# EAGLE schematic harp behavior (EAGLE 9.6.2)

## Sheet 1 of 4
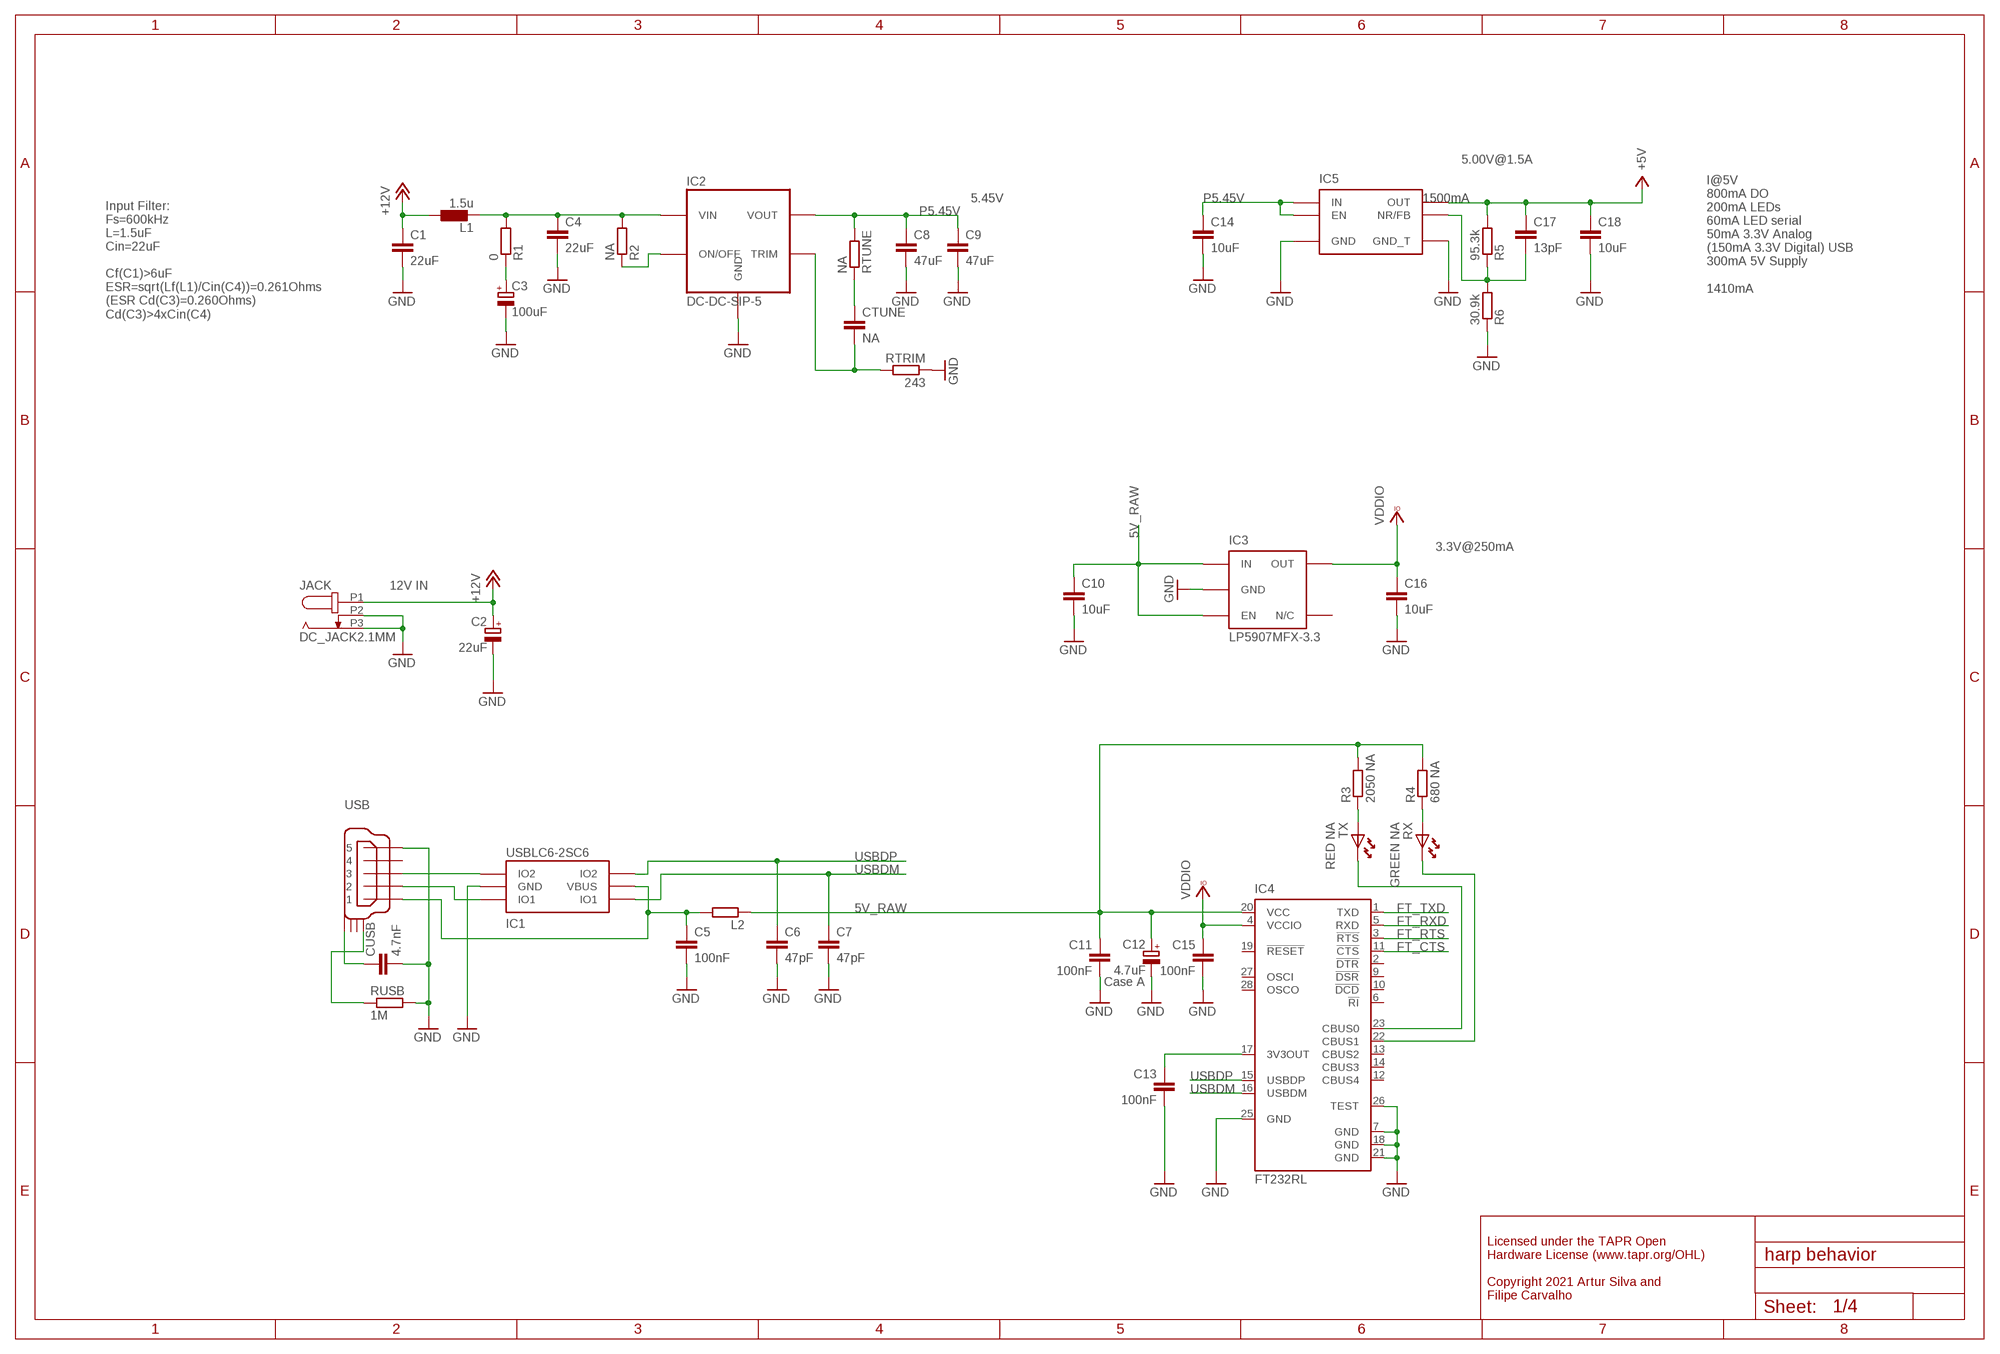
[diagram p0: schematic, sheet 1]

### Parts
C1  22uF  C-EUC1210  [C1210]
C2  22uF  CAP_100UFHAND  [CAP_100UF_HAND]
C3  100uF  CPOL-EUE  [PANASONIC_E]
C4  22uF  C-EUC1210  [C1210]
C5  100nF  C-EUC0402  [C0402]
C6  47pF  C-EUC0402  [C0402]
C7  47pF  C-EUC0402  [C0402]
C8  47uF  C-EUC1210  [C1210]
C9  47uF  C-EUC1210  [C1210]
C10  10uF  C-EUC0603  [C0603]
C11  100nF  C-EUC0402  [C0402]
C12  4.7uF  CPOL-EUA/3216-18W  [A/3216-18W]
C13  100nF  C-EUC0402  [C0402]
C14  10uF  C-EUC0603  [C0603]
C15  100nF  C-EUC0402  [C0402]
C16  10uF  C-EUC0603  [C0603]
C17  13pF  C-EUC0402  [C0402]
C18  10uF  C-EUC0603  [C0603]
CTUNE  NA  C-EUC0402  [C0402]
CUSB  4.7nF  C-EUC0402  [C0402]
IC1  USBLC6-2SC6  USBLC6-2  [SOT23-6L]
IC2  DC-DC-SIP-5  [SIP-5]
IC3  LP5907MFX-3.3  TLV700XX  [TSOT23-5]
IC4  FT232RL  [SSOP28]
IC5  TPS78601SON  [SON-8]
JACK  DC_JACK2.1MM  [DC_POWER_INPUT_2.1MM]
L1  1.5u  INDLPS4012_L  [IND_LPS4012_V2]
L2  ???  R-EU_R0805  [R0805]
R1  0  R-EU_R0402  [R0402]
R2  NA  R-EU_R0402  [R0402]
R3  2050 NA  R-EU_R0402  [R0402]
R4  680 NA  R-EU_R0402  [R0402]
R5  95.3k  R-EU_R0402  [R0402]
R6  30.9k  R-EU_R0402  [R0402]
RTRIM  243  R-EU_R0402  [R0402]
RTUNE  NA  R-EU_R0402  [R0402]
RUSB  1M  R-EU_R0402  [R0402]
RX  GREEN NA  LEDHAND  [LED_HAND]
TX  RED NA  LEDHAND  [LED_HAND]
USB  USB_MINI_B  [240-0002-1]

### Nets
5V_RAW: C10.1 C11.1 C12.+ IC3.1(IN) IC3.3(EN) IC4.20(VCC) L2.1 R3.2 R4.2
+5V: C17.1 C18.1 IC5.P3(OUT) IC5.P4(OUT) R5.2 ; also sheet 2,3,4
+12V: C1.1 C2.+ JACK.P1 L1.1 ; also sheet 4
DCIN: C4.1 IC2.P2(VIN) L1.2 R1.2 R2.2
FT_CTS: IC4.11(!CTS) ; also sheet 2
FT_RTS: IC4.3(!RTS) ; also sheet 2
FT_RXD: IC4.5(RXD) ; also sheet 2
FT_TXD: IC4.1(TXD) ; also sheet 2
GND: C1.2 C2.- C3.- C4.2 C5.2 C6.2 C7.2 C8.2 C9.2 C10.2 C11.2 C12.- C13.2 C14.2 C15.2 C16.2 C18.2 CUSB.2 IC1.P$2(GND) IC2.P3(GND) IC3.2(GND) IC4.7(GND) IC4.18(GND) IC4.21(GND) IC4.25(GND) IC4.26(TEST) IC5.P6(GND) IC5.P9(GND_T) JACK.P2 JACK.P3 R6.1 RTRIM.1 RUSB.2 USB.P$5 ; also sheet 2,3,4
N$12: CTUNE.2 IC2.P5(TRIM) RTRIM.2
N$14: CTUNE.1 RTUNE.1
N$16: IC2.P1(ON/OFF) R2.1
N$20: C17.2 IC5.P5(NR/FB) R5.1 R6.2
N$24: C3.+ R1.1
N$38: C13.1 IC4.17(3V3OUT)
N$39: C5.1 IC1.P$5(VBUS) L2.2 USB.P$1
N$40: IC1.P$1(IO1) USB.P$2
N$47: R4.1 RX.A
N$48: IC4.23(CBUS0) TX.K
N$49: IC4.22(CBUS1) RX.K
N$50: IC1.P$3(IO2) USB.P$3
N$59: CUSB.1 USB.SHIELD_4
N$61: RUSB.1 USB.SHIELD_1
N$62: R3.1 TX.A
P5.45V: C8.1 C9.1 C14.1 IC2.P4(VOUT) IC5.P1(IN) IC5.P2(IN) IC5.P8(EN) RTUNE.2
USBDM: C7.1 IC1.P$6(IO1) IC4.16(USBDM)
USBDP: C6.1 IC1.P$4(IO2) IC4.15(USBDP)
VCCIO: C15.1 C16.1 IC3.5(OUT) IC4.4(VCCIO) ; supply symbol labelled VDDIO ; also sheet 2,3,4
Unconnected: IC3.4(N/C) IC4.2(!DTR) IC4.6(!RI) IC4.9(!DSR) IC4.10(!DCD) IC4.12(CBUS4) IC4.13(CBUS2) IC4.14(CBUS3) IC4.19(!RESET) IC4.27(OSCI) IC4.28(OSCO) USB.P$4 USB.SHIELD_2 USB.SHIELD_3

### Notes on the sheet
- 5.00V@1.5A
- 5.45V | 1500mA
- I@5V
  800mA DO
  200mA LEDs
  60mA LED serial
  50mA 3.3V Analog
  (150mA 3.3V Digital) USB
  300mA 5V Supply
  
  1410mA
- Input Filter:
  Fs=600kHz
  L=1.5uF
  Cin=22uF
  
  Cf(C1)>6uF
  ESR=sqrt(Lf(L1)/Cin(C4))=0.261Ohms
  (ESR Cd(C3)=0.260Ohms)
  Cd(C3)>4xCin(C4)
- 3.3V@250mA
- 12V IN
- Case A
- Licensed under the TAPR Open
  Hardware License (www.tapr.org/OHL)
  
  Copyright 2021 Artur Silva and 
  Filipe Carvalho

## Sheet 2 of 4
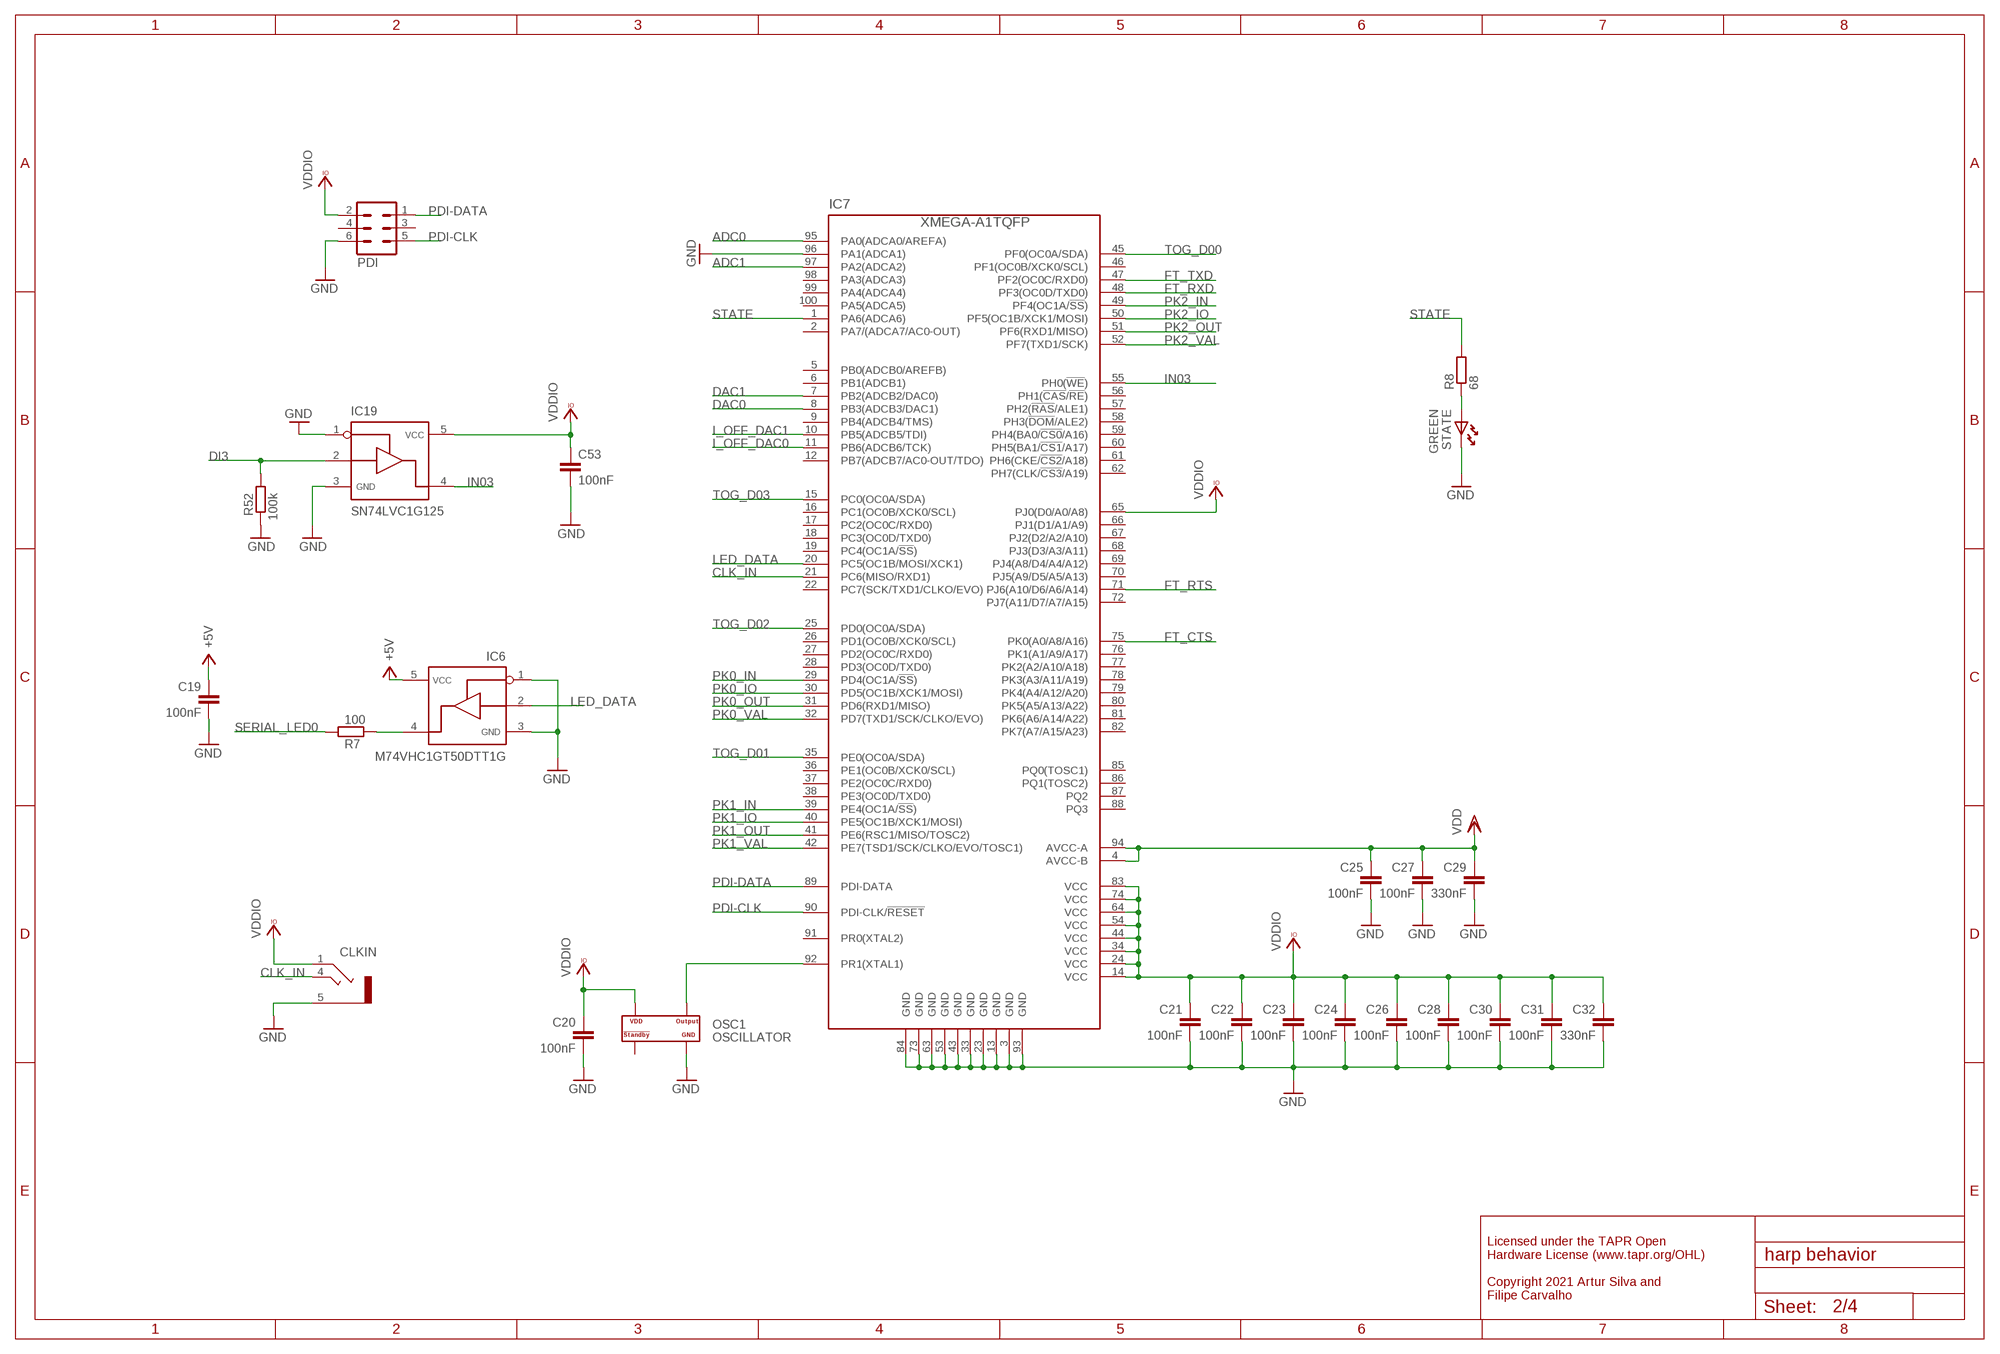
[diagram p1: schematic, sheet 2]

### Parts
C19  100nF  C-EUC0402  [C0402]
C20  100nF  C-EUC0402  [C0402]
C21  100nF  C-EUC0402  [C0402]
C22  100nF  C-EUC0402  [C0402]
C23  100nF  C-EUC0402  [C0402]
C24  100nF  C-EUC0402  [C0402]
C25  100nF  C-EUC0402  [C0402]
C26  100nF  C-EUC0402  [C0402]
C27  100nF  C-EUC0402  [C0402]
C28  100nF  C-EUC0402  [C0402]
C29  330nF  C-EUC0402  [C0402]
C30  100nF  C-EUC0402  [C0402]
C31  100nF  C-EUC0402  [C0402]
C32  330nF  C-EUC0402  [C0402]
C53  100nF  C-EUC0402  [C0402]
CLKIN  STEREO_JACK  [35RASMT2BHNTRX]
IC6  M74VHC1GT50DTT1G  SN74LVC1G125  [SOT23-5]
IC7  XMEGA-A1TQFP  [TQFP100]
IC19  SN74LVC1G125  [SOT23-5]
OSC1  OSCILLATOR  [OSCILLATOR_3.2X2.5]
PDI  MA03-2  [MA03-2]
R7  100  R-EU_R0402  [R0402]
R8  68  R-EU_R0402  [R0402]
R52  100k  R-EU_R0402  [R0402]
STATE  GREEN  LEDHAND  [LED_HAND]

### Nets
+5V: C19.1 IC6.5 ; also sheet 1,3,4
ADC0: IC7.95(PA0(ADCA0/AREFA)) ; also sheet 3
ADC1: IC7.97(PA2(ADCA2)) ; also sheet 3
CLK_IN: CLKIN.4 IC7.21(PC6(MISO/RXD1))
DAC0: IC7.8(PB3(ADCB3/DAC1)) ; also sheet 3
DAC1: IC7.7(PB2(ADCB2/DAC0)) ; also sheet 3
DI3: IC19.2 R52.1 ; also sheet 3
FT_CTS: IC7.75(PK0(A0/A8/A16)) ; also sheet 1
FT_RTS: IC7.71(PJ6(A10/D6/A6/A14)) ; also sheet 1
FT_RXD: IC7.48(PF3(OC0D/TXD0)) ; also sheet 1
FT_TXD: IC7.47(PF2(OC0C/RXD0)) ; also sheet 1
GND: C19.2 C20.2 C21.2 C22.2 C23.2 C24.2 C25.2 C26.2 C27.2 C28.2 C29.2 C30.2 C31.2 C32.2 C53.2 CLKIN.5 IC6.1 IC6.3 IC7.3(GND) IC7.13(GND) IC7.23(GND) IC7.33(GND) IC7.43(GND) IC7.53(GND) IC7.63(GND) IC7.73(GND) IC7.84(GND) IC7.93(GND) IC7.96(PA1(ADCA1)) IC19.1 IC19.3 OSC1.P$2(GND) PDI.6 R52.2 STATE.K ; also sheet 1,3,4
I_OFF_DAC0: IC7.11(PB6(ADCB6/TCK)) ; also sheet 3
I_OFF_DAC1: IC7.10(PB5(ADCB5/TDI)) ; also sheet 3
IN03: IC7.55(PH0(!WE!)) IC19.4
LED_DATA: IC6.2 IC7.20(PC5(OC1B/MOSI/XCK1))
N$13: IC6.4 R7.2
N$23: R8.1 STATE.A
OSC1: IC7.92(PR1(XTAL1)) OSC1.P$3(OUTPUT)
PDI-CLK: IC7.90(PDI-CLK/!RESET) PDI.5
PDI-DATA: IC7.89(PDI-DATA) PDI.1
PK0_IN: IC7.29(PD4(OC1A/!SS!)) ; also sheet 4
PK0_IO: IC7.30(PD5(OC1B/XCK1/MOSI)) ; also sheet 4
PK0_OUT: IC7.31(PD6(RXD1/MISO)) ; also sheet 4
PK0_VAL: IC7.32(PD7(TXD1/SCK/CLKO/EVO)) ; also sheet 4
PK1_IN: IC7.39(PE4(OC1A/!SS!)) ; also sheet 4
PK1_IO: IC7.40(PE5(OC1B/XCK1/MOSI)) ; also sheet 4
PK1_OUT: IC7.41(PE6(RSC1/MISO/TOSC2)) ; also sheet 4
PK1_VAL: IC7.42(PE7(TSD1/SCK/CLKO/EVO/TOSC1)) ; also sheet 4
PK2_IN: IC7.49(PF4(OC1A/!SS!)) ; also sheet 4
PK2_IO: IC7.50(PF5(OC1B/XCK1/MOSI)) ; also sheet 4
PK2_OUT: IC7.51(PF6(RXD1/MISO)) ; also sheet 4
PK2_VAL: IC7.52(PF7(TXD1/SCK)) ; also sheet 4
SERIAL_LED0: R7.1 ; also sheet 3
STATE: IC7.1(PA6(ADCA6)) R8.2
TOG_D00: IC7.45(PF0(OC0A/SDA)) ; also sheet 3
TOG_D01: IC7.35(PE0(OC0A/SDA)) ; also sheet 3
TOG_D02: IC7.25(PD0(OC0A/SDA)) ; also sheet 3
TOG_D03: IC7.15(PC0(OC0A/SDA)) ; also sheet 3
VCCIO: C20.1 C21.1 C22.1 C23.1 C24.1 C26.1 C28.1 C30.1 C31.1 C32.1 C53.1 CLKIN.1 IC7.14(VCC) IC7.24(VCC) IC7.34(VCC) IC7.44(VCC) IC7.54(VCC) IC7.64(VCC) IC7.65(PJ0(D0/A0/A8)) IC7.74(VCC) IC7.83(VCC) IC19.5 OSC1.P$4(VDD) PDI.2 ; supply symbol labelled VDDIO ; also sheet 1,3,4
VDD: C25.1 C27.1 C29.1 IC7.4(AVCC-B) IC7.94(AVCC-A) ; also sheet 3
Unconnected: IC7.2(PA7/(ADCA7/AC0-OUT)) IC7.5(PB0(ADCB0/AREFB)) IC7.6(PB1(ADCB1)) IC7.9(PB4(ADCB4/TMS)) IC7.12(PB7(ADCB7/AC0-OUT/TDO)) IC7.16(PC1(OC0B/XCK0/SCL)) IC7.17(PC2(OC0C/RXD0)) IC7.18(PC3(OC0D/TXD0)) IC7.19(PC4(OC1A/!SS!)) IC7.22(PC7(SCK/TXD1/CLKO/EVO)) IC7.26(PD1(OC0B/XCK0/SCL)) IC7.27(PD2(OC0C/RXD0)) IC7.28(PD3(OC0D/TXD0)) IC7.36(PE1(OC0B/XCK0/SCL)) IC7.37(PE2(OC0C/RXD0)) IC7.38(PE3(OC0D/TXD0)) IC7.46(PF1(OC0B/XCK0/SCL)) IC7.56(PH1(!CAS!/!RE!)) IC7.57(PH2(!RAS!/ALE1)) IC7.58(PH3(!DOM!/ALE2)) IC7.59(PH4(BA0/!CS0!/A16)) IC7.60(PH5(BA1/!CS1!/A17)) IC7.61(PH6(CKE/!CS2!/A18)) IC7.62(PH7(CLK/!CS3!/A19)) IC7.66(PJ1(D1/A1/A9)) IC7.67(PJ2(D2/A2/A10)) IC7.68(PJ3(D3/A3/A11)) IC7.69(PJ4(A8/D4/A4/A12)) IC7.70(PJ5(A9/D5/A5/A13)) IC7.72(PJ7(A11/D7/A7/A15)) IC7.76(PK1(A1/A9/A17)) IC7.77(PK2(A2/A10/A18)) IC7.78(PK3(A3/A11/A19)) IC7.79(PK4(A4/A12/A20)) IC7.80(PK5(A5/A13/A22)) IC7.81(PK6(A6/A14/A22)) IC7.82(PK7(A7/A15/A23)) IC7.85(PQ0(TOSC1)) IC7.86(PQ1(TOSC2)) IC7.87(PQ2) IC7.88(PQ3) IC7.91(PR0(XTAL2)) IC7.98(PA3(ADCA3)) IC7.99(PA4(ADCA4)) IC7.100(PA5(ADCA5)) OSC1.P$1(STANDBY#) PDI.3 PDI.4

### Notes on the sheet
- Licensed under the TAPR Open
  Hardware License (www.tapr.org/OHL)
  
  Copyright 2021 Artur Silva and 
  Filipe Carvalho

## Sheet 3 of 4
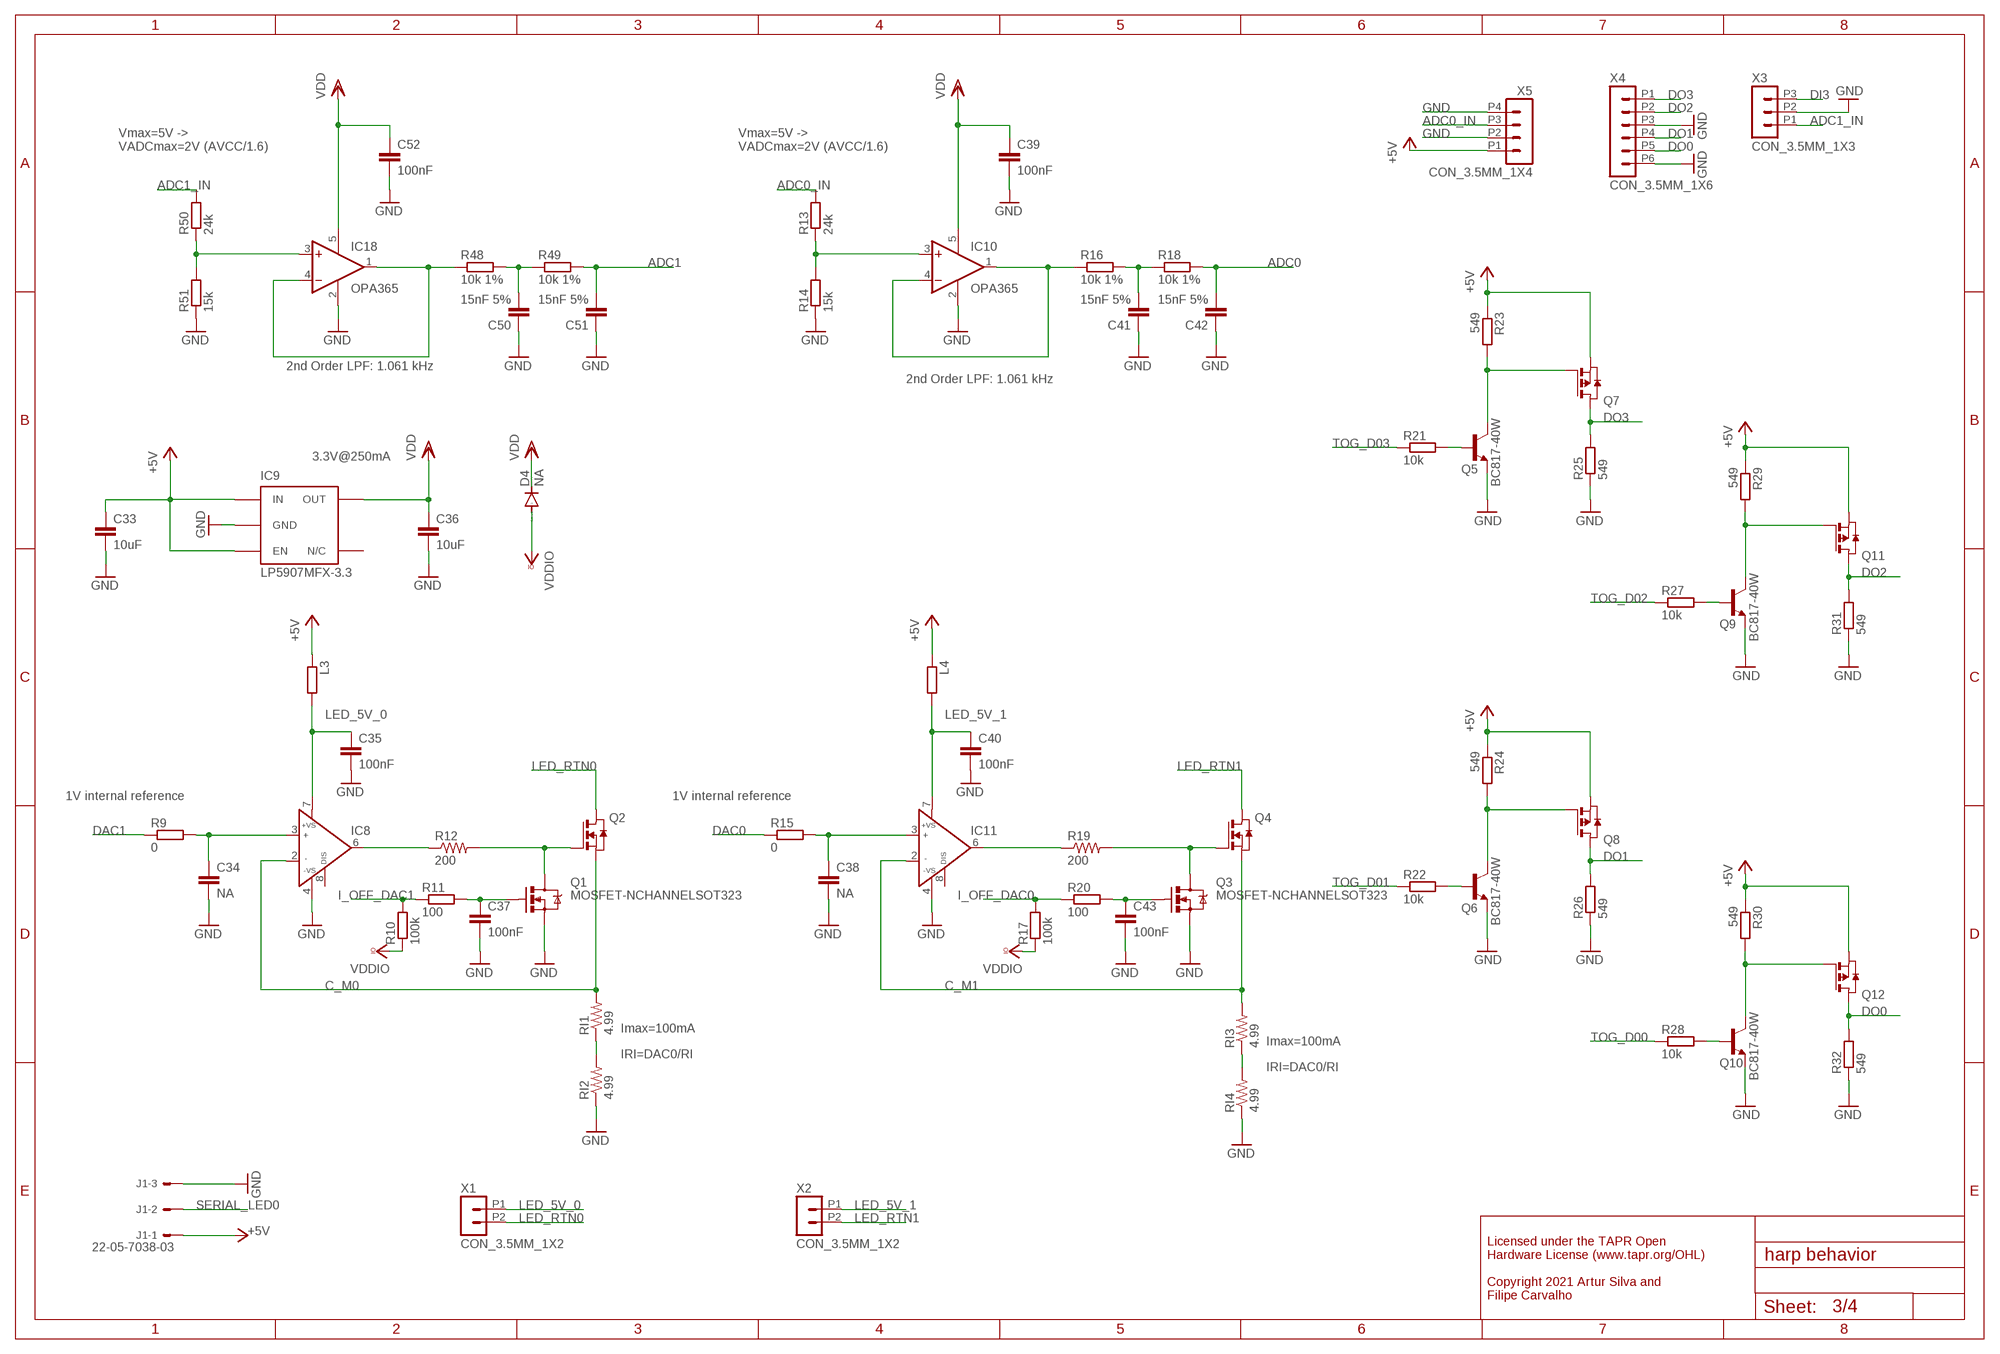
[diagram p2: schematic, sheet 3]

### Parts
C33  10uF  C-EUC0603  [C0603]
C34  NA  C-EUC0402  [C0402]
C35  100nF  C-EUC0402  [C0402]
C36  10uF  C-EUC0603  [C0603]
C37  100nF  C-EUC0402  [C0402]
C38  NA  C-EUC0402  [C0402]
C39  100nF  C-EUC0402  [C0402]
C40  100nF  C-EUC0402  [C0402]
C41  15nF 5%  C-EUC0402  [C0402]
C42  15nF 5%  C-EUC0402  [C0402]
C43  100nF  C-EUC0402  [C0402]
C50  15nF 5%  C-EUC0402  [C0402]
C51  15nF 5%  C-EUC0402  [C0402]
C52  100nF  C-EUC0402  [C0402]
D4  NA  DIODE  [SOD-323-DIODE]
IC8  AD8041R  [SO8]
IC9  LP5907MFX-3.3  TLV700XX  [TSOT23-5]
IC10  OPA365  [SOT23-5]
IC11  AD8041R  [SO8]
IC18  OPA365  [SOT23-5]
J1  22-05-7038-03  [7395-03]
L3  600@100M  R-EU_R0805  [R0805]
L4  600@100M  R-EU_R0805  [R0805]
Q1  MOSFET-NCHANNELSOT323  [SOT323]
Q2  NMOSSOT223  [SOT223]
Q3  MOSFET-NCHANNELSOT323  [SOT323]
Q4  NMOSSOT223  [SOT223]
Q5  BC817-40W  BC817  [SOT323-BEC]
Q6  BC817-40W  BC817  [SOT323-BEC]
Q7  PMOSSOT223  [SOT223]
Q8  PMOSSOT223  [SOT223]
Q9  BC817-40W  BC817  [SOT323-BEC]
Q10  BC817-40W  BC817  [SOT323-BEC]
Q11  PMOSSOT223  [SOT223]
Q12  PMOSSOT223  [SOT223]
R9  0  R-EU_R0402  [R0402]
R10  100k  R-EU_R0402  [R0402]
R11  100  R-EU_R0402  [R0402]
R12  200  R-US_R1210  [R1210]
R13  24k  R-EU_R0402  [R0402]
R14  15k  R-EU_R0402  [R0402]
R15  0  R-EU_R0402  [R0402]
R16  10k 1%  R-EU_R0402  [R0402]
R17  100k  R-EU_R0402  [R0402]
R18  10k 1%  R-EU_R0402  [R0402]
R19  200  R-US_R1210  [R1210]
R20  100  R-EU_R0402  [R0402]
R21  10k  R-EU_R0402  [R0402]
R22  10k  R-EU_R0402  [R0402]
R23  549  R-EU_R0805  [R0805]
R24  549  R-EU_R0805  [R0805]
R25  549  R-EU_R0805  [R0805]
R26  549  R-EU_R0805  [R0805]
R27  10k  R-EU_R0402  [R0402]
R28  10k  R-EU_R0402  [R0402]
R29  549  R-EU_R0805  [R0805]
R30  549  R-EU_R0805  [R0805]
R31  549  R-EU_R0805  [R0805]
R32  549  R-EU_R0805  [R0805]
R48  10k 1%  R-EU_R0402  [R0402]
R49  10k 1%  R-EU_R0402  [R0402]
R50  24k  R-EU_R0402  [R0402]
R51  15k  R-EU_R0402  [R0402]
RI1  4.99  R-US_R2512  [R2512]
RI2  4.99  R-US_R2512  [R2512]
RI3  4.99  R-US_R2512  [R2512]
RI4  4.99  R-US_R2512  [R2512]
X1  CON_3.5MM_1X2  [CON_3.5MM_1X2]
X2  CON_3.5MM_1X2  [CON_3.5MM_1X2]
X3  CON_3.5MM_1X3  [CON_3.5MM_1X3]
X4  CON_3.5MM_1X6  [CON_3.5MM_1X6]
X5  CON_3.5MM_1X4  [CON_3.5MM_1X4]

### Nets
+5V: C33.1 IC9.1(IN) IC9.3(EN) J1.1 L3.1 L4.1 Q7.3(S) Q8.3(S) Q11.3(S) Q12.3(S) R23.1 R24.1 R29.1 R30.1 X5.P1 ; also sheet 1,2,4
ADC0: C42.2 R18.2 ; also sheet 2
ADC0_IN: R13.2 X5.P3
ADC1: C51.2 R49.2 ; also sheet 2
ADC1_IN: R50.2 X3.P1
C_M0: IC8.2(IN-) Q2.3(S) RI1.2
C_M1: IC11.2(IN-) Q4.3(S) RI3.2
CTRL_BL: IC11.6(OUT) R19.1
CTRL_BL1: IC8.6(OUT) R12.1
DAC0: R15.1 ; also sheet 2
DAC1: R9.1 ; also sheet 2
DI3: X3.P3 ; also sheet 2
DO0: Q12.2(D) Q12.4(D) R32.2 X4.P5
DO1: Q8.2(D) Q8.4(D) R26.2 X4.P4
DO2: Q11.2(D) Q11.4(D) R31.2 X4.P2
DO3: Q7.2(D) Q7.4(D) R25.2 X4.P1
GND: C33.2 C34.2 C35.2 C36.2 C37.2 C38.2 C39.2 C40.2 C41.1 C42.1 C43.2 C50.1 C51.1 C52.2 IC8.4(-VS) IC9.2(GND) IC10.2(V-) IC11.4(-VS) IC18.2(V-) J1.3 Q1.2(S) Q3.2(S) Q5.E Q6.E Q9.E Q10.E R14.1 R25.1 R26.1 R31.1 R32.1 R51.1 RI2.1 RI4.1 X3.P2 X4.P3 X4.P6 X5.P2 X5.P4 ; also sheet 1,2,4
I_OFF_DAC0: R17.2 R20.1 ; also sheet 2
I_OFF_DAC1: R10.2 R11.1 ; also sheet 2
LED_5V_0: C35.1 IC8.7(+VS) L3.2 X1.P1
LED_5V_1: C40.1 IC11.7(+VS) L4.2 X2.P1
LED_RTN0: Q2.2(D) Q2.4(D) X1.P2
LED_RTN1: Q4.2(D) Q4.4(D) X2.P2
N$1: Q3.3(D) Q4.1(G) R19.2
N$3: Q6.C Q8.1(G) R24.2
N$5: Q6.B R22.2
N$7: Q9.C Q11.1(G) R29.2
N$8: Q9.B R27.2
N$9: Q10.C Q12.1(G) R30.2
N$10: Q10.B R28.2
N$11: Q1.3(D) Q2.1(G) R12.2
N$15: C34.1 IC8.3(IN+) R9.2
N$18: C50.2 R48.2 R49.1
N$19: IC18.1(OUT) IC18.4(-IN) R48.1
N$21: C38.1 IC11.3(IN+) R15.2
N$22: RI1.1 RI2.2
N$25: Q5.C Q7.1(G) R23.2
N$27: Q5.B R21.2
N$28: C37.1 Q1.1(G) R11.2
N$29: IC18.3(+IN) R50.1 R51.2
N$30: C43.1 Q3.1(G) R20.2
N$45: RI3.1 RI4.2
N$56: C41.2 R16.2 R18.1
N$58: IC10.1(OUT) IC10.4(-IN) R16.1
N$64: IC10.3(+IN) R13.1 R14.2
SERIAL_LED0: J1.2 ; also sheet 2
TOG_D00: R28.1 ; also sheet 2
TOG_D01: R22.1 ; also sheet 2
TOG_D02: R27.1 ; also sheet 2
TOG_D03: R21.1 ; also sheet 2
VCCIO: D4.A R10.1 R17.1 ; supply symbol labelled VDDIO ; also sheet 1,2,4
VDD: C36.1 C39.1 C52.1 D4.C IC9.5(OUT) IC10.5(V+) IC18.5(V+) ; also sheet 2
Unconnected: IC8.8(DISABLE) IC9.4(N/C) IC11.8(DISABLE)

### Notes on the sheet
- Vmax=5V -> 
  VADCmax=2V (AVCC/1.6)
- Vmax=5V -> 
  VADCmax=2V (AVCC/1.6)
- 2nd Order LPF: 1.061 kHz
- 2nd Order LPF: 1.061 kHz
- 3.3V@250mA
- 1V internal reference | 1V internal reference
- Imax=100mA
- Imax=100mA
- IRI=DAC0/RI
- IRI=DAC0/RI
- Licensed under the TAPR Open
  Hardware License (www.tapr.org/OHL)
  
  Copyright 2021 Artur Silva and 
  Filipe Carvalho

## Sheet 4 of 4
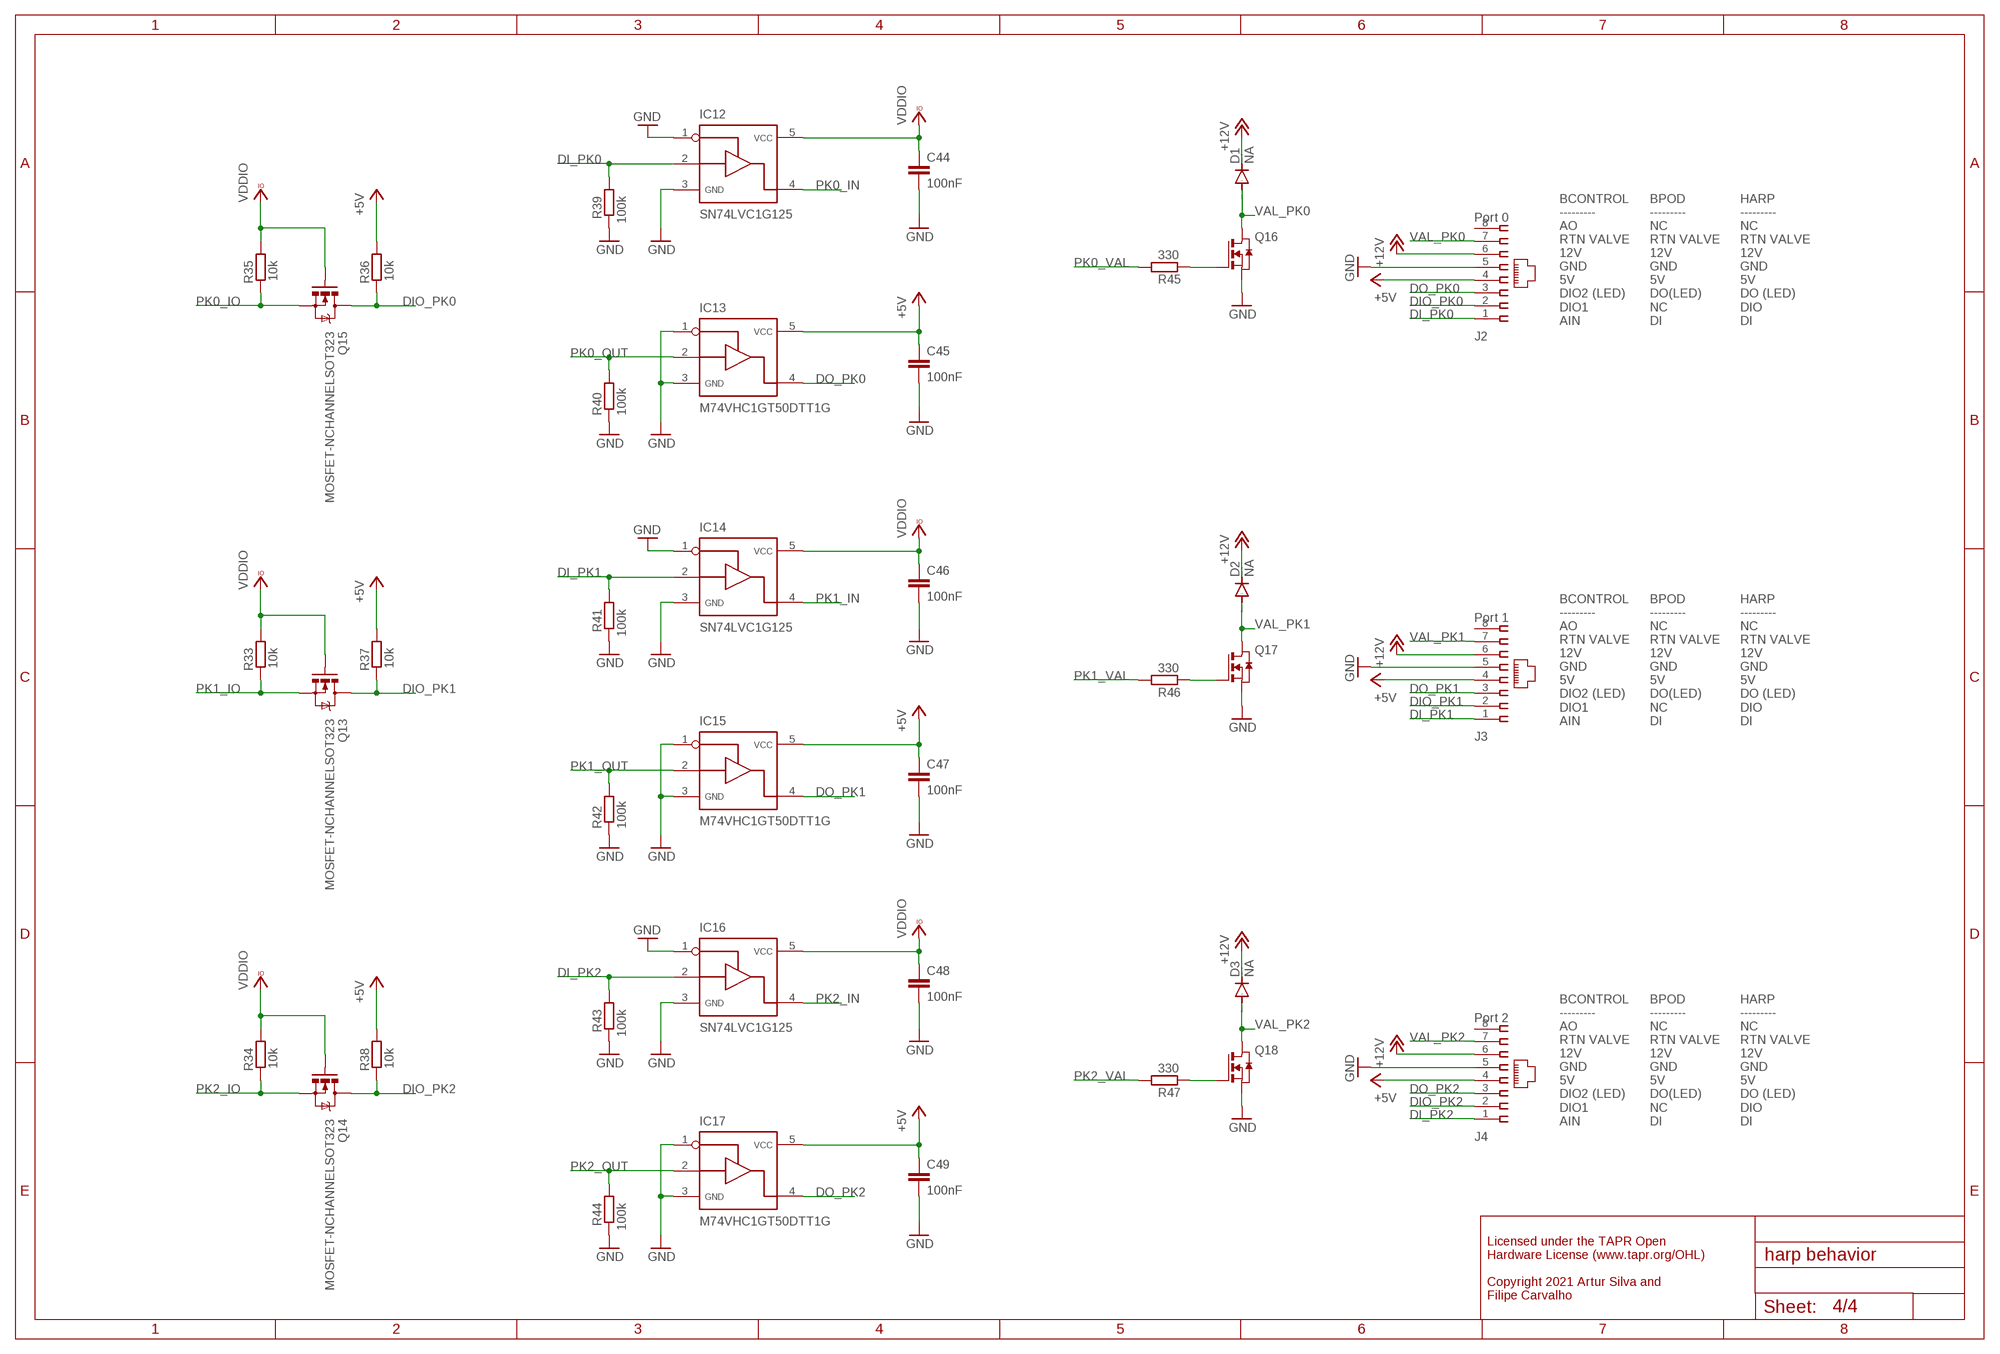
[diagram p3: schematic, sheet 4]

### Parts
C44  100nF  C-EUC0402  [C0402]
C45  100nF  C-EUC0402  [C0402]
C46  100nF  C-EUC0402  [C0402]
C47  100nF  C-EUC0402  [C0402]
C48  100nF  C-EUC0402  [C0402]
C49  100nF  C-EUC0402  [C0402]
D1  NA  DIODE  [SOD-323-DIODE]
D2  NA  DIODE  [SOD-323-DIODE]
D3  NA  DIODE  [SOD-323-DIODE]
IC12  SN74LVC1G125  [SOT23-5]
IC13  M74VHC1GT50DTT1G  SN74LVC1G125  [SOT23-5]
IC14  SN74LVC1G125  [SOT23-5]
IC15  M74VHC1GT50DTT1G  SN74LVC1G125  [SOT23-5]
IC16  SN74LVC1G125  [SOT23-5]
IC17  M74VHC1GT50DTT1G  SN74LVC1G125  [SOT23-5]
J2  Port 0  520426-4  [520426-4]
J3  Port 1  520426-4  [520426-4]
J4  Port 2  520426-4  [520426-4]
Q13  MOSFET-NCHANNELSOT323  [SOT323]
Q14  MOSFET-NCHANNELSOT323  [SOT323]
Q15  MOSFET-NCHANNELSOT323  [SOT323]
Q16  NMOSSOT223  [SOT223]
Q17  NMOSSOT223  [SOT223]
Q18  NMOSSOT223  [SOT223]
R33  10k  R-EU_R0402  [R0402]
R34  10k  R-EU_R0402  [R0402]
R35  10k  R-EU_R0402  [R0402]
R36  10k  R-EU_R0402  [R0402]
R37  10k  R-EU_R0402  [R0402]
R38  10k  R-EU_R0402  [R0402]
R39  100k  R-EU_R0402  [R0402]
R40  100k  R-EU_R0402  [R0402]
R41  100k  R-EU_R0402  [R0402]
R42  100k  R-EU_R0402  [R0402]
R43  100k  R-EU_R0402  [R0402]
R44  100k  R-EU_R0402  [R0402]
R45  330  R-EU_R0402  [R0402]
R46  330  R-EU_R0402  [R0402]
R47  330  R-EU_R0402  [R0402]

### Nets
+5V: C45.1 C47.1 C49.1 IC13.5 IC15.5 IC17.5 J2.4 J3.4 J4.4 R36.1 R37.1 R38.1 ; also sheet 1,2,3
+12V: D1.C D2.C D3.C J2.6 J3.6 J4.6 ; also sheet 1
DI_PK0: IC12.2 J2.1 R39.1
DI_PK1: IC14.2 J3.1 R41.1
DI_PK2: IC16.2 J4.1 R43.1
DIO_PK0: J2.2 Q15.3(D) R36.2
DIO_PK1: J3.2 Q13.3(D) R37.2
DIO_PK2: J4.2 Q14.3(D) R38.2
DO_PK0: IC13.4 J2.3
DO_PK1: IC15.4 J3.3
DO_PK2: IC17.4 J4.3
GND: C44.2 C45.2 C46.2 C47.2 C48.2 C49.2 IC12.1 IC12.3 IC13.1 IC13.3 IC14.1 IC14.3 IC15.1 IC15.3 IC16.1 IC16.3 IC17.1 IC17.3 J2.5 J3.5 J4.5 Q16.3(S) Q17.3(S) Q18.3(S) R39.2 R40.1 R41.2 R42.1 R43.2 R44.2 ; also sheet 1,2,3
N$2: Q16.1(G) R45.2
N$4: Q17.1(G) R46.2
N$6: Q18.1(G) R47.2
PK0_IN: IC12.4 ; also sheet 2
PK0_IO: Q15.2(S) R35.2 ; also sheet 2
PK0_OUT: IC13.2 R40.2 ; also sheet 2
PK0_VAL: R45.1 ; also sheet 2
PK1_IN: IC14.4 ; also sheet 2
PK1_IO: Q13.2(S) R33.2 ; also sheet 2
PK1_OUT: IC15.2 R42.2 ; also sheet 2
PK1_VAL: R46.1 ; also sheet 2
PK2_IN: IC16.4 ; also sheet 2
PK2_IO: Q14.2(S) R34.2 ; also sheet 2
PK2_OUT: IC17.2 R44.1 ; also sheet 2
PK2_VAL: R47.1 ; also sheet 2
VAL_PK0: D1.A J2.7 Q16.2(D) Q16.4(D)
VAL_PK1: D2.A J3.7 Q17.2(D) Q17.4(D)
VAL_PK2: D3.A J4.7 Q18.2(D) Q18.4(D)
VCCIO: C44.1 C46.1 C48.1 IC12.5 IC14.5 IC16.5 Q13.1(G) Q14.1(G) Q15.1(G) R33.1 R34.1 R35.1 ; supply symbol labelled VDDIO ; also sheet 1,2,3
Unconnected: J2.8 J3.8 J4.8

### Notes on the sheet
- BCONTROL
  ---------
  AO
  RTN VALVE
  12V
  GND
  5V
  DIO2 (LED)
  DIO1
  AIN
- BPOD 
  ---------
  NC
  RTN VALVE
  12V
  GND
  5V
  DO(LED)
  NC
  DI
- HARP
  ---------
  NC
  RTN VALVE
  12V
  GND
  5V
  DO (LED)
  DIO
  DI
- BCONTROL
  ---------
  AO
  RTN VALVE
  12V
  GND
  5V
  DIO2 (LED)
  DIO1
  AIN
- BPOD 
  ---------
  NC
  RTN VALVE
  12V
  GND
  5V
  DO(LED)
  NC
  DI
- HARP
  ---------
  NC
  RTN VALVE
  12V
  GND
  5V
  DO (LED)
  DIO
  DI
- BCONTROL
  ---------
  AO
  RTN VALVE
  12V
  GND
  5V
  DIO2 (LED)
  DIO1
  AIN
- BPOD 
  ---------
  NC
  RTN VALVE
  12V
  GND
  5V
  DO(LED)
  NC
  DI
- HARP
  ---------
  NC
  RTN VALVE
  12V
  GND
  5V
  DO (LED)
  DIO
  DI
- Licensed under the TAPR Open
  Hardware License (www.tapr.org/OHL)
  
  Copyright 2021 Artur Silva and 
  Filipe Carvalho

## Library data of the parts
C1 C4-C11 C13-C53 CTUNE CUSB = rcl:C-EU: CAPACITOR, European symbol
C2 = CNP-miscellaneous:CAP_100UF
C3 C12 = rcl:CPOL-EU: POLARIZED CAPACITOR, European symbol
CLKIN = CNP-connectors:STEREO_JACK
D1-D4 = CNP-miscellaneous:DIODE
IC1 = CNP 2:USBLC6-2
IC2 = CNP-connectors:DC-DC-SIP-5
IC3 IC9 = CNP:TLV700XX
IC4 = ftdichip:FT232R: Source: http://www.ftdichip.com/Documents/DataSheets/DS_FT232R_v104.pdf; MPN: FT232RL; OC_FARNELL: 1146032; OC_NEWARK: 91K9918
IC5 = CNP-ics 1:TPS78601
IC6 IC12-IC17 IC19 = My_library 0v2:SN74LVC1G125
IC7 = avr-7:XMEGA-A1: Atmel XMega A1 Series processor
IC8 IC11 = analog-devices:AD8041: 160 MHz Rail-to-Rail Amplifier with Disable Source: http://www.analog.com/static/imported-files/data_sheets/AD8041.pdf; MF: ALTERA CORPORATION; MPN: AD8041ARZ; OC_FARNELL: 1464831; OC_NEWARK: 88H0130
IC10 IC18 = CNP-ics 2:OPA365
J1 = con-molex:22-?-03: CONNECTOR wire to board 2.54 mm (.1 inch) pitch header; OC_FARNELL: unknown; OC_NEWARK: unknown
J2-J4 = con-amp:520426-4: AMP connector
JACK = CNP-miscellaneous:DC_JACK
L1 = CNP-miscellaneous:IND
L2-L4 R1-R11 R13-R18 R20-R52 RTRIM RTUNE RUSB = rcl:R-EU_: RESISTOR, European symbol
OSC1 = CNP-miscellaneous:OSCILLATOR
PDI = con-lstb:MA03-2: PIN HEADER; OC_FARNELL: unknown; OC_NEWARK: unknown
Q1 Q3 Q13-Q15 = fets:MOSFET-NCHANNEL: Generic NMOS footprint
Q2 Q4 Q16-Q18 = zetex:NMOSSOT223: MOS FET; OC_FARNELL: unknown; OC_NEWARK: unknown
Q5 Q6 Q9 Q10 = transistor-npn:BC817*: NPN Transistor
Q7 Q8 Q11 Q12 = zetex:PMOSSOT223: MOS FET; OC_FARNELL: unknown; OC_NEWARK: unknown
R12 R19 RI1-RI4 = rcl:R-US_: RESISTOR, American symbol
RX STATE TX = CNP-miscellaneous:LED
USB = CNP-connectors:USB_MINI_B
X1 X2 = CNP-connectors:CON_3.5MM_1X2
X3 = CNP-connectors:CON_3.5MM_1X3
X4 = CNP-connectors:CON_3.5MM_1X6
X5 = CNP-connectors:CON_3.5MM_1X4